# EAGLE design Rotating_stand (EAGLE 9.6.2)
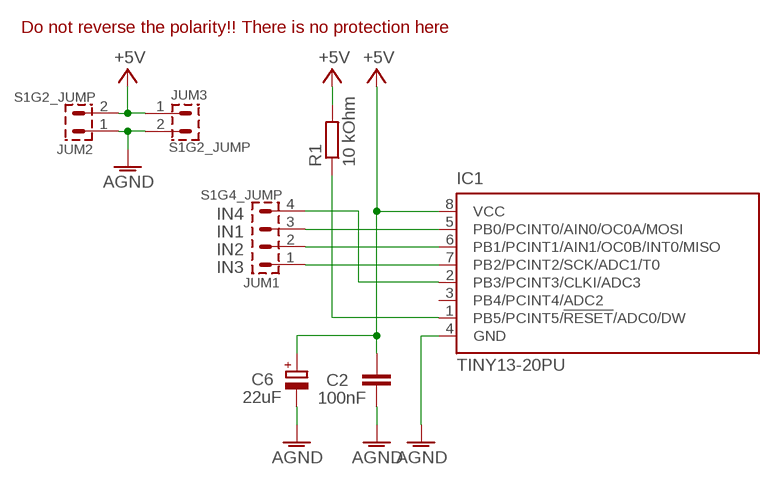
[diagram p0: schematic, sheet 1]

## Parts
C2  100nF  C-EU050-024X044  [C050-024X044]
C6  22uF  CPOL-EUE2.5-5  [E2,5-5]
IC1  TINY13-20PU  [DIL08]
JUM1  S1G4_JUMP  [S1G4_JUM]
JUM2  S1G2_JUMP  [S1G2_JUM]
JUM3  S1G2_JUMP  [S1G2_JUM]
R1  10 kOhm  R-EU_0207/7  [0207/7]

## Nets
+5V: C2.1 C6.+ IC1.8(VCC) JUM2.2 JUM3.1 R1.2
AGND: C2.2 C6.- IC1.4(GND) JUM2.1 JUM3.2
N$1: IC1.1(PB5/PCINT5/!RESET!/ADC0/DW) R1.1
N$2: IC1.2(PB3/PCINT3/CLKI/ADC3) JUM1.4
N$3: IC1.5(PB0/PCINT0/AIN0/OC0A/MOSI) JUM1.3
N$4: IC1.6(PB1/PCINT1/AIN1/OC0B/INT0/MISO) JUM1.2
N$5: IC1.7(PB2/PCINT2/SCK/ADC1/T0) JUM1.1
Unconnected: IC1.3(PB4/PCINT4/ADC2)

## Notes on the sheet
- Do not reverse the polarity!! There is no protection here
- IN4
- IN1
- IN2
- IN3

## Library data of the parts
C2 = rcl:C-EU: CAPACITOR, European symbol; SPICEPREFIX: C
C6 = rcl:CPOL-EU: POLARIZED CAPACITOR, European symbol; SPICEPREFIX: C
IC1 = atmel:TINY13: 8-bit AVR Microcontroller with 1K Bytes In-System Programmable Flash Source: http://www.atmel.com/dyn/resources/prod_documents/2535S.pdf; MPN: ATTINY13-20PU; OC_FARNELL: 9171550; OC_NEWARK: 96K6521
JUM1 = #PaJa_konektory:S1G4_JUMP: Radove konektory - koliky - 4x
JUM2 JUM3 = #PaJa_konektory:S1G2_JUMP: Radove konektory - koliky - 2x
R1 = rcl:R-EU_: RESISTOR, European symbol; SPICEPREFIX: R

## Board
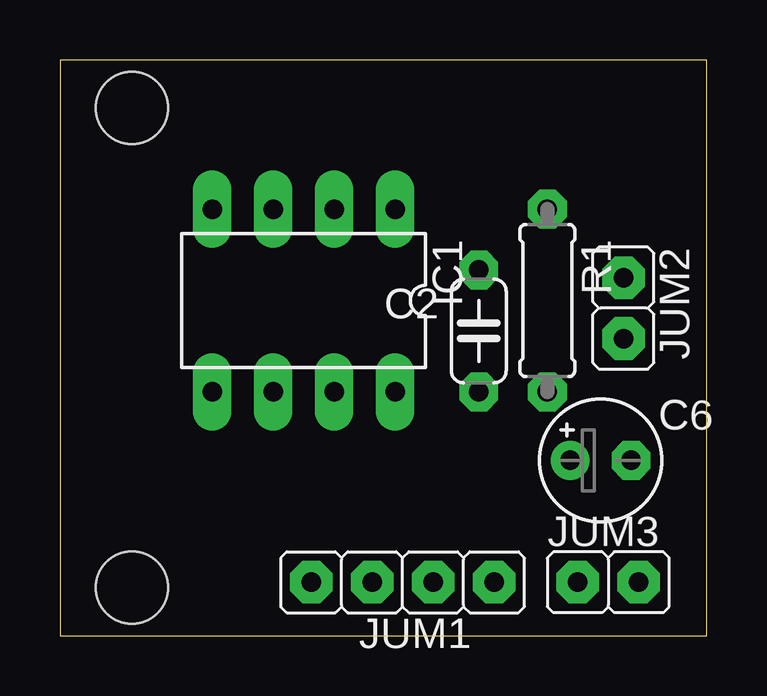
[diagram p1: board, top side]
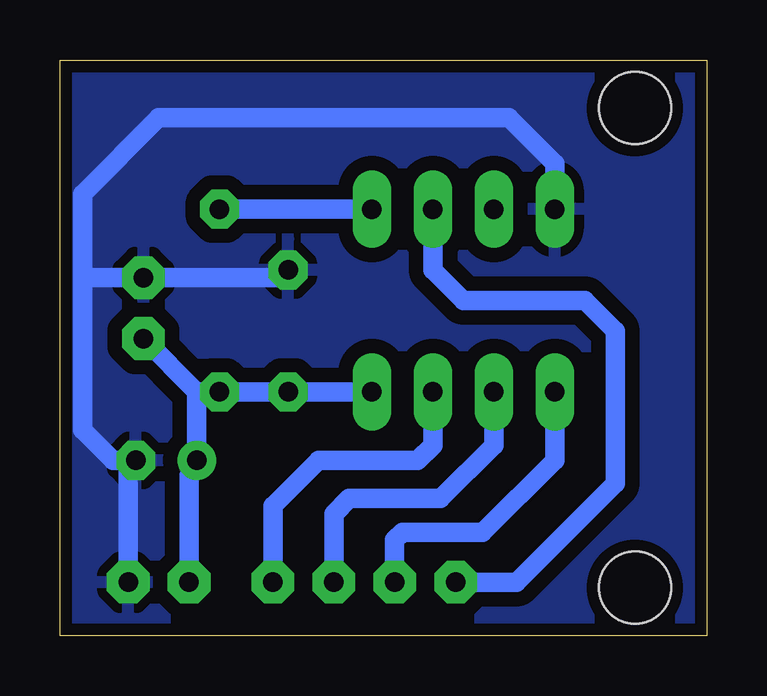
[diagram p2: board, bottom side, seen from below]

Size 26.98 x 24 mm. Coordinates in mm from the lower left corner, seen from the top.
Outline: 0,0 26.98,0 26.98,24 0,24 0,0
Copper layers (1*16): Top 0.035mm / dielectric 1.5mm / Bottom 0.035mm
Design rules "2 vrstvy trida 3 *": minimum track width 0.4mm, minimum drill 0.8mm, track to track 0.6mm, track to pad 0.6mm, pad to pad 0.4mm, via to via 0.4mm, smd to smd 0.4mm, copper to edge 0.5mm, drill to drill 0.8mm, minimum pad ring 0.4mm, minimum via ring 0.4mm, stop-mask expansion 0.15mm, vias tented up to drill 3mm, thermal gap 0.4mm
Holes 3 mm at 3,2 3,22

### Footprints (pad centres in the part's own frame; a part is rotated, then mirrored left to right if it is on the bottom)
C050-024X044 = drill 0.813 octagon: 1 -2.54,0; 2 2.54,0
E2,5-5 = drill 0.813 pad 1.6: + -1.27,0 | drill 0.813 pad 1.6 octagon: - 1.27,0
DIL08 = drill 0.813 long: 1 -3.81,-3.81; 2 -1.27,-3.81; 3 1.27,-3.81; 4 3.81,-3.81; 5 3.81,3.81; 6 1.27,3.81; 7 -1.27,3.81; 8 -3.81,3.81
S1G4_JUM = drill 0.813 pad 1.778 octagon: 1 -3.81,0; 2 -1.27,0; 3 1.27,0; 4 3.81,0
S1G2_JUM = drill 0.813 pad 1.778 octagon: 1 -1.27,0; 2 1.27,0
0207/7 = drill 0.813 octagon: 1 -3.81,0; 2 3.81,0

### Placement (x,y rotation side)
C2  17.46,12.7 90 top
C6  22.54,7.3 0 top
IC1  10.16,13.97 180 top
JUM1  14.29,2.22 180 top
JUM2  23.5,13.65 270 top
JUM3  22.86,2.22 0 top
R1  20.32,13.97 270 top

### Tracks (layer width: path | path; a pad name or v marks a point on that pad's centre or on a via)
+5V
  Bottom 0.813: IC1.8 C2.1 R1.2 21.27,10.16 | 21.27,10.16 C6.+ 21.11,7.14 21.59,6.67 JUM3.1 | JUM2.2 21.27,10.16
AGND
  Bottom 0.813: C2.2 17.78,14.92 JUM2.1 26.04,14.92 | 26.04,14.92 26.04,8.57 24.77,7.3 C6.- 24.13,6.99 JUM3.2 | 26.04,14.92 26.04,18.41 22.86,21.59 8.26,21.59 6.35,19.68 IC1.4
  pour Bottom: 0,23.81 26.99,23.81 26.99,-0.08 0,-0.08
N$1
  Bottom 0.813: IC1.1 R1.1
N$2
  Bottom 0.813: JUM1.4 7.94,2.22 3.81,6.35 3.81,12.7 5.08,13.97 10.16,13.97 11.43,15.24 IC1.2
N$3
  Bottom 0.813: IC1.5 6.35,7.3 9.35,4.3 12.7,4.3 13.02,3.98 JUM1.3
N$4
  Bottom 0.813: JUM1.2 15.56,5.08 14.92,5.71 11.11,5.71 8.89,7.94 IC1.6
N$5
  Bottom 0.813: IC1.7 11.43,7.94 12.06,7.3 16.19,7.3 18.1,5.4 JUM1.1